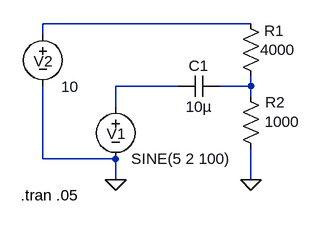
[diagram p0: schematic dcshift.asc]
dcshift.asc, the LTspice schematic file:
Version 4
SHEET 1 880 680
WIRE 176 -16 -144 -16
WIRE -144 0 -144 -16
WIRE 64 80 -32 80
WIRE 176 80 176 64
WIRE 176 80 128 80
WIRE 176 96 176 80
WIRE -32 112 -32 80
WIRE -144 192 -144 80
WIRE -32 192 -144 192
WIRE -32 224 -32 192
WIRE 176 224 176 176
FLAG -32 224 0
FLAG 176 224 0
SYMBOL voltage -32 96 R0
WINDOW 0 -14 57 Left 2
WINDOW 123 0 0 Left 2
WINDOW 39 0 0 Left 2
SYMATTR InstName V1
SYMATTR Value SINE(5 2 100)
SYMBOL cap 128 64 R90
WINDOW 0 0 32 VBottom 2
WINDOW 3 32 32 VTop 2
SYMATTR InstName C1
SYMATTR Value 10µ
SYMBOL res 192 80 R180
WINDOW 0 -35 85 Left 2
WINDOW 3 -52 56 Left 2
SYMATTR InstName R1
SYMATTR Value 4000
SYMBOL res 192 192 R180
WINDOW 0 -37 87 Left 2
WINDOW 3 -59 57 Left 2
SYMATTR InstName R2
SYMATTR Value 1000
SYMBOL voltage -144 -16 R0
WINDOW 0 -14 58 Left 2
WINDOW 3 28 97 Left 2
WINDOW 123 0 0 Left 2
WINDOW 39 0 0 Left 2
SYMATTR InstName V2
SYMATTR Value 10
TEXT -178 248 Left 2 !.tran .05

The netlist it stands for:
* dcshift.asc
V1 N002 0 SINE(5 2 100)
C1 N003 N002 10µ
R1 N003 N001 4000
R2 0 N003 1000
V2 N001 0 10
.tran .05
.backanno
.end